# EAGLE design M960 (EAGLE 6.6.0)
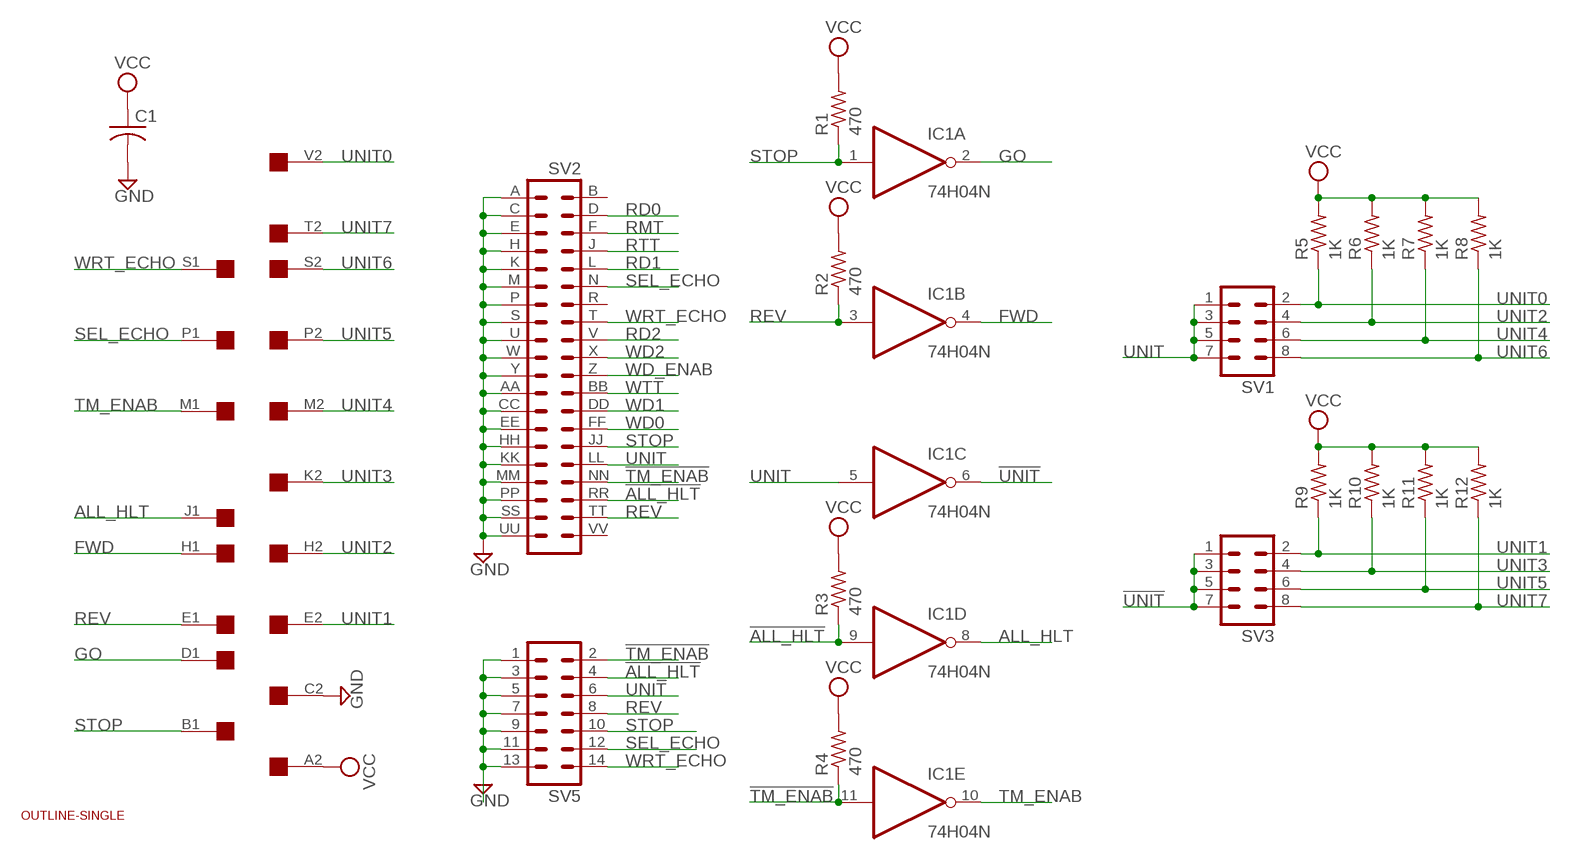
[diagram p0: schematic, sheet 1]

## Parts
C1  C-US050-025X075  [C050-025X075]
IC1  74H04N  7404N  [DIL14]
R1  470  R-US_0207/10  [0207/10]
R2  470  R-US_0207/10  [0207/10]
R3  470  R-US_0207/10  [0207/10]
R4  470  R-US_0207/10  [0207/10]
R5  1K  R-US_0207/10  [0207/10]
R6  1K  R-US_0207/10  [0207/10]
R7  1K  R-US_0207/10  [0207/10]
R8  1K  R-US_0207/10  [0207/10]
R9  1K  R-US_0207/10  [0207/10]
R10  1K  R-US_0207/10  [0207/10]
R11  1K  R-US_0207/10  [0207/10]
R12  1K  R-US_0207/10  [0207/10]
SV1  MA04-2  [MA04-2]
SV2  DEC40PINV  [DEC40PINV]
SV3  MA04-2  [MA04-2]
SV5  MA07-2  [MA07-2]
U$1  OUTLINE-SINGLE  [SINGLE]
U$2  SINGLE  [EDGE-CON2]

## Nets
!ALL_HLT: IC1.9(D:I) R3.1 SV2.RR SV5.4
!TM_ENAB: IC1.11(E:I) R4.1 SV2.NN SV5.2
!UNIT: IC1.6(C:O) SV3.1 SV3.3 SV3.5 SV3.7
ALL_HLT: IC1.8(D:O) U$2.J1
FWD: IC1.4(B:O) U$2.H1
GND: C1.2 SV2.A SV2.AA SV2.C SV2.CC SV2.E SV2.EE SV2.H SV2.HH SV2.K SV2.KK SV2.M SV2.MM SV2.P SV2.PP SV2.S SV2.SS SV2.U SV2.UU SV2.W SV2.Y SV5.1 SV5.3 SV5.5 SV5.7 SV5.9 SV5.11 SV5.13 U$2.C2
GO: IC1.2(A:O) U$2.D1
RD0: SV2.D
RD1: SV2.L
RD2: SV2.V
REV: IC1.3(B:I) R2.1 SV2.TT SV5.8 U$2.E1
RMT: SV2.F
RTT: SV2.J
SEL_ECHO: SV2.N SV5.12 U$2.P1
STOP: IC1.1(A:I) R1.1 SV2.JJ SV5.10 U$2.B1
TM_ENAB: IC1.10(E:O) U$2.M1
UNIT: IC1.5(C:I) SV1.1 SV1.3 SV1.5 SV1.7 SV2.LL SV5.6
UNIT0: R5.1 SV1.2 U$2.V2
UNIT1: R9.1 SV3.2 U$2.E2
UNIT2: R6.1 SV1.4 U$2.H2
UNIT3: R10.1 SV3.4 U$2.K2
UNIT4: R7.1 SV1.6 U$2.M2
UNIT5: R11.1 SV3.6 U$2.P2
UNIT6: R8.1 SV1.8 U$2.S2
UNIT7: R12.1 SV3.8 U$2.T2
VCC: C1.1 R1.2 R2.2 R3.2 R4.2 R5.2 R6.2 R7.2 R8.2 R9.2 R10.2 R11.2 R12.2 U$2.A2
WD0: SV2.FF
WD1: SV2.DD
WD2: SV2.X
WD_ENAB: SV2.Z
WRT_ECHO: SV2.T SV5.14 U$2.S1
WTT: SV2.BB
Unconnected: IC1.12(F:O) IC1.13(F:I) SV2.B SV2.R SV2.VV U$2.A1 U$2.B2 U$2.C1 U$2.D2 U$2.F1 U$2.F2 U$2.J2 U$2.K1 U$2.L1 U$2.L2 U$2.N1 U$2.N2 U$2.R1 U$2.R2 U$2.T1 U$2.U1 U$2.U2 U$2.V1

## Power pins joined to a net without a drawn wire
GND: IC1.7(P:GND)
VCC: IC1.14(P:VCC)

## Library data of the parts
C1 = rcl:C-US: CAPACITOR, American symbol
IC1 = 74xx-us:74*04: Hex INVERTER
R1-R12 = rcl:R-US_: RESISTOR, American symbol
SV1 SV3 = con-lstb:MA04-2: PIN HEADER; OC_FARNELL: unknown; OC_NEWARK: unknown
SV2 = dec-con:DEC40PIN: PIN HEADER
SV5 = con-lstb:MA07-2: PIN HEADER; OC_FARNELL: unknown; OC_NEWARK: unknown
U$1 = dec-con:OUTLINE-*: Board outlines for DEC boards.
U$2 = dec-con:SINGLE: Single-Height DEC board

## Board
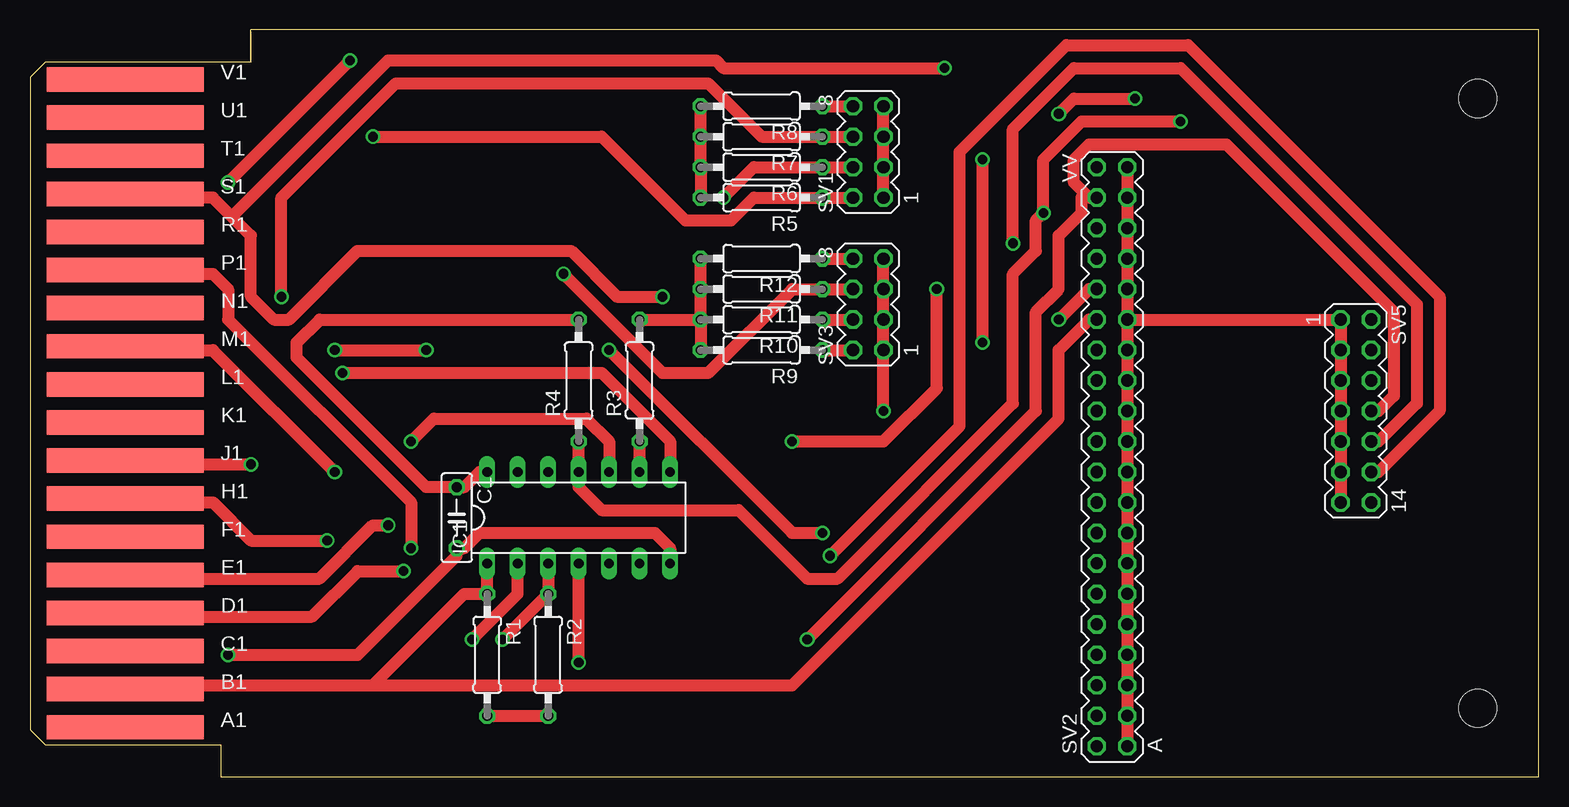
[diagram p1: board, top side]
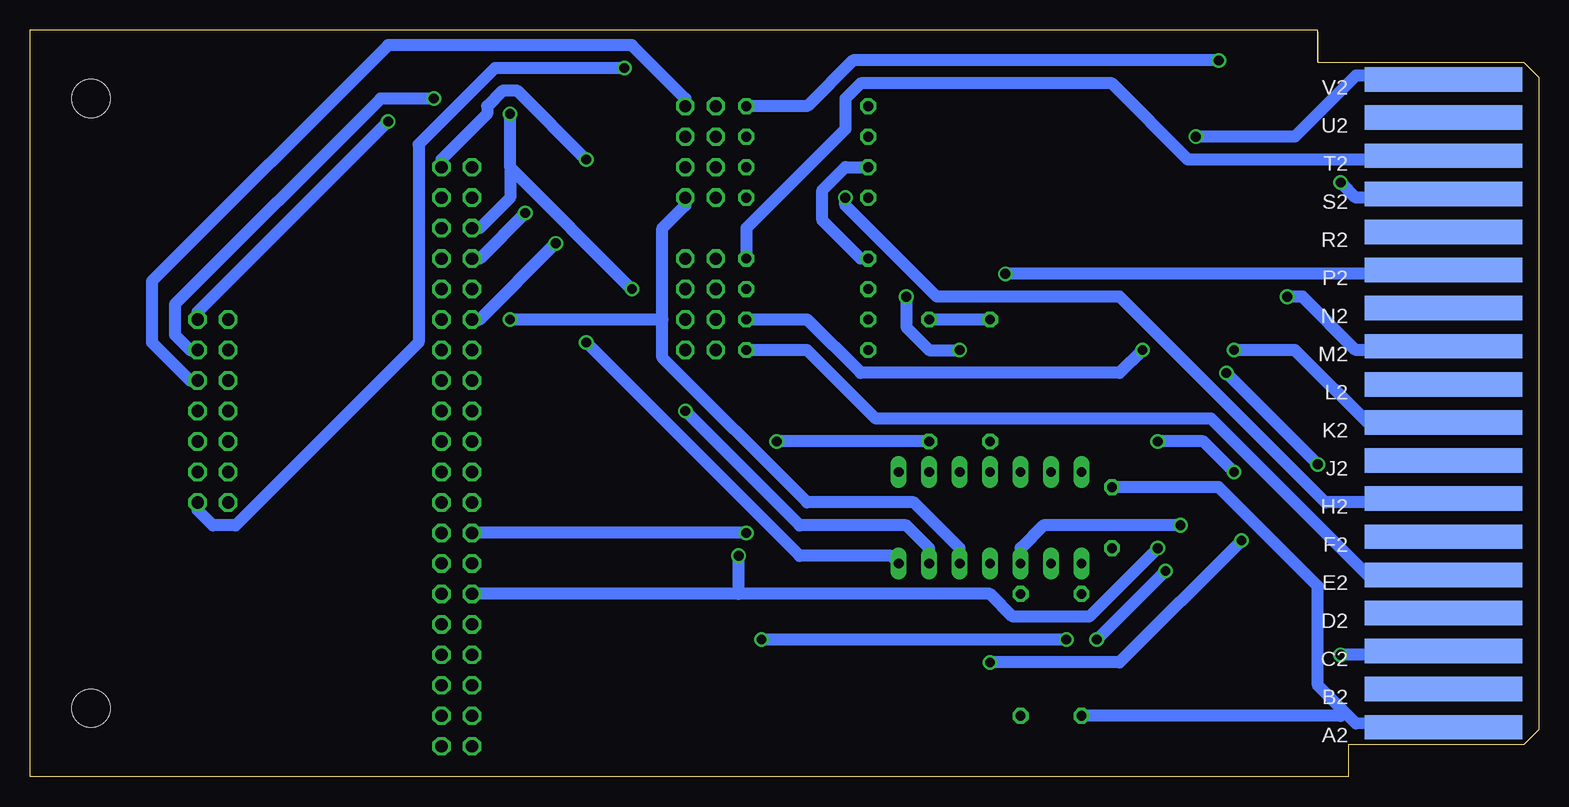
[diagram p2: board, bottom side, seen from below]

Size 125.73 x 62.23 mm. Coordinates in mm from the lower left corner, seen from the top.
Copper layers (1+16): Top 0.035mm / dielectric 1.5mm / Bottom 0.035mm
Design rules "16mils": minimum track width 16mil, minimum drill 32mil, track to track 15mil, track to pad 10mil, pad to pad 10mil, via to via 10mil, smd to smd 10mil, copper to edge 13mil, drill to drill 10mil, minimum pad ring 10mil, minimum via ring 8mil, stop-mask expansion 0mil, vias tented up to drill 0mil, thermal gap 10mil

### Footprints (pad centres in the part's own frame; a part is rotated, then mirrored left to right if it is on the bottom)
C050-025X075 = drill 0.813 octagon: 1 -2.54,0; 2 2.54,0
DIL14 = drill 0.813 long: 1 -7.62,-3.81; 2 -5.08,-3.81; 3 -2.54,-3.81; 4 0,-3.81; 5 2.54,-3.81; 6 5.08,-3.81; 7 7.62,-3.81; 8 7.62,3.81; 9 5.08,3.81; 10 2.54,3.81; 11 0,3.81; 12 -2.54,3.81; 13 -5.08,3.81; 14 -7.62,3.81
0207/10 = drill 0.813 octagon: 1 -5.08,0; 2 5.08,0
MA04-2 = drill 1.016 octagon: 1 -3.81,-1.27; 2 -3.81,1.27; 3 -1.27,-1.27; 4 -1.27,1.27; 5 1.27,-1.27; 6 1.27,1.27; 7 3.81,-1.27; 8 3.81,1.27
DEC40PINV = drill 1.016 octagon: A -24.13,-1.27; AA 3.81,-1.27; B -24.13,1.27; BB 3.81,1.27; C -21.59,-1.27; CC 6.35,-1.27; D -21.59,1.27; DD 6.35,1.27; E -19.05,-1.27; EE 8.89,-1.27; F -19.05,1.27; FF 8.89,1.27; H -16.51,-1.27; HH 11.43,-1.27; J -16.51,1.27; JJ 11.43,1.27; K -13.97,-1.27; KK 13.97,-1.27; L -13.97,1.27; LL 13.97,1.27; M -11.43,-1.27; MM 16.51,-1.27; N -11.43,1.27; NN 16.51,1.27; P -8.89,-1.27; PP 19.05,-1.27; R -8.89,1.27; RR 19.05,1.27; S -6.35,-1.27; SS 21.59,-1.27; T -6.35,1.27; TT 21.59,1.27; U -3.81,-1.27; UU 24.13,-1.27; V -3.81,1.27; VV 24.13,1.27; W -1.27,-1.27; X -1.27,1.27; Y 1.27,-1.27; Z 1.27,1.27
MA07-2 = drill 1.016 octagon: 1 -7.62,-1.27; 2 -7.62,1.27; 3 -5.08,-1.27; 4 -5.08,1.27; 5 -2.54,-1.27; 6 -2.54,1.27; 7 0,-1.27; 8 0,1.27; 9 2.54,-1.27; 10 2.54,1.27; 11 5.08,-1.27; 12 5.08,1.27; 13 7.62,-1.27; 14 7.62,1.27
SINGLE = hole 3.175: 120.65,56.515; 120.65,5.715
EDGE-CON2 = smd 13.106 x 2.032: A1 7.938,4.128; B1 7.938,7.303; C1 7.938,10.477; D1 7.938,13.652; E1 7.938,16.828; F1 7.938,20.003; H1 7.938,23.177; J1 7.938,26.352; K1 7.938,29.527; L1 7.938,32.703; M1 7.938,35.877; N1 7.938,39.053; P1 7.938,42.227; R1 7.938,45.403; S1 7.938,48.578; T1 7.938,51.752; U1 7.938,54.928; V1 7.938,58.102 | smd 13.106 x 2.032 bottom: A2 7.938,4.128; B2 7.938,7.303; C2 7.938,10.477; D2 7.938,13.652; E2 7.938,16.828; F2 7.938,20.003; H2 7.938,23.177; J2 7.938,26.352; K2 7.938,29.527; L2 7.938,32.703; M2 7.938,35.877; N2 7.938,39.053; P2 7.938,42.227; R2 7.938,45.403; S2 7.938,48.578; T2 7.938,51.752; U2 7.938,54.928; V2 7.938,58.102

### Placement (x,y rotation side)
C1  35.56,21.59 270 top
IC1  45.72,21.59 0 top
R1  38.1,10.16 270 top
R2  43.18,10.16 270 top
R3  50.8,33.02 90 top
R4  45.72,33.02 90 top
R5  60.96,48.26 180 top
R6  60.96,50.8 180 top
R7  60.96,53.34 180 top
R8  60.96,55.88 180 top
R9  60.96,35.56 180 top
R10  60.96,38.1 180 top
R11  60.96,40.64 180 top
R12  60.96,43.18 180 top
SV1  69.85,52.07 90 top
SV2  90.17,26.67 90 top
SV3  69.85,39.37 90 top
SV5  110.49,30.48 270 top
U$1  0,0 0 top
U$2  0,0 0 top

### Tracks (layer width: path | path; a pad name or v marks a point on that pad's centre or on a via)
!ALL_HLT  (via drill 0.81)
  Top 1.016: IC1.9 R3.1 | v92.08,56.52 87,56.52 v85.73,55.24 | v63.5,27.94 71.12,27.94 75.57,32.38 v75.57,40.64
  Bottom 1.016: v92.08,56.52 96.52,56.52 113.67,39.37 113.67,36.83 112.4,35.56 SV5.4 | 85.73,50.8 85.73,48.26 88.27,45.72 SV2.RR | 85.73,50.8 v85.73,55.24 | v75.57,40.64 85.73,50.8 | R3.1 v63.5,27.94
!TM_ENAB  (via drill 0.81)
  Top 1.016: R4.1 IC1.11 45.72,24.13 47.63,22.23 59.06,22.23 64.77,16.51 67.31,16.51 81.92,31.11 81.92,41.91 83.82,43.81 83.82,46.35 v84.46,46.99 84.46,51.44 87.63,54.61 v95.89,54.61
  Bottom 1.016: v95.89,54.61 111.76,38.73 SV5.2 | v84.46,46.99 88.27,43.18 SV2.NN
!UNIT  (via drill 0.81)
  Top 1.016: v71.12,30.48 SV3.1 SV3.3 SV3.5 SV3.7
  Bottom 1.016: v71.12,30.48 61.6,20.95 52.71,20.95 50.8,19.05 IC1.6
ALL_HLT  (via drill 0.81)
  Top 1.016: v26.04,33.66 47.63,33.66 53.34,27.94 IC1.8 | v18.42,26.04 12.7,26.04 U$2.J1
  Bottom 1.016: v18.42,26.04 v26.04,33.66
FWD  (via drill 0.81)
  Top 1.016: v24.77,19.68 18.42,19.68 15.24,22.86 13.97,22.86 U$2.H1 | v45.72,9.53 IC1.4
  Bottom 1.016: v45.72,9.53 34.93,9.53 v24.77,19.68
GND  (via drill 0.81)
  Top 1.016: SV5.13 SV5.11 SV5.9 SV5.7 SV5.5 SV5.3 SV5.1 SV2.HH | SV2.A SV2.C SV2.E SV2.H SV2.K SV2.M SV2.P SV2.S SV2.U SV2.W SV2.Y SV2.AA SV2.CC SV2.EE SV2.HH | SV2.HH SV2.KK SV2.MM SV2.PP SV2.SS SV2.UU | IC1.7 53.34,19.05 52.07,20.32 37.47,20.32 36.2,19.05 C1.2 35.56,18.41 27.31,10.16 v16.51,10.16 | v79.38,36.2 v79.38,51.44
  Bottom 1.016: U$2.C2 13.97,10.16 v16.51,10.16 | v79.38,51.44 85.09,57.15 86.36,57.15 87.63,55.88 87.63,55.24 91.44,51.44 SV2.UU | v79.38,36.2 61.6,18.41 53.98,18.41 IC1.7
GO  (via drill 0.81)
  Top 1.016: v36.83,11.43 40.64,15.24 IC1.2 | v31.12,17.14 27.31,17.14 23.5,13.34 12.7,13.34 U$2.D1
  Bottom 1.016: v31.12,17.14 v36.83,11.43
REV  (via drill 0.81)
  Top 1.016: 87.95,48.58 87,49.53 87,51.44 88.27,52.7 99.7,52.7 113.67,38.73 113.67,31.75 112.4,30.48 SV5.8 | 87.95,48.58 88.27,48.26 SV2.TT | IC1.3 R2.1 v39.37,11.43 | v29.85,20.95 28.58,20.95 24.13,16.51 12.7,16.51 U$2.E1 | v64.77,11.43 83.82,30.48 83.82,38.73 85.73,40.64 85.73,45.09 87.63,46.99 87.63,48.26 87.95,48.58
  Bottom 1.016: v29.85,20.95 41.28,20.95 43.18,19.05 IC1.3 | v39.37,11.43 v64.77,11.43
SEL_ECHO  (via drill 0.81)
  Top 1.016: v31.75,19.05 31.75,22.86 16.51,38.1 16.51,40.64 15.24,41.91 13.97,41.91 U$2.P1 | v66.68,18.41 77.47,29.21 77.47,52.07 86.36,60.96 96.52,60.96 117.48,40.01 117.48,30.48 112.4,25.4 SV5.12
  Bottom 1.016: 66.68,15.24 45.72,15.24 43.82,13.34 37.47,13.34 v31.75,19.05 | 66.68,15.24 SV2.N | 66.68,15.24 v66.68,18.41
STOP  (via drill 0.81)
  Top 1.016: IC1.1 R1.1 36.2,15.24 28.58,7.62 | 28.58,7.62 13.97,7.62 U$2.B1 | 28.58,7.62 63.5,7.62 85.73,29.84 85.73,35.56 88.27,38.1 SV2.JJ | v81.92,44.45 81.92,53.98 87,59.05 95.89,59.05 115.57,39.37 115.57,31.11 112.4,27.94 SV5.10
  Bottom 1.016: v81.92,44.45 88.27,38.1 SV2.JJ
TM_ENAB  (via drill 0.81)
  Top 1.016: v31.75,27.94 33.66,29.84 46.36,29.84 48.26,27.94 IC1.10 | v25.4,25.4 15.24,35.56 13.97,35.56 U$2.M1
  Bottom 1.016: v31.75,27.94 27.94,27.94 v25.4,25.4
UNIT  (via drill 0.81)
  Top 1.016: SV1.1 SV1.3 SV1.5 SV1.7 | v85.73,38.1 88.27,40.64 SV2.LL
  Bottom 1.016: 73.03,38.1 73.03,45.72 71.12,47.62 SV1.1 | 73.03,38.1 73.03,34.92 60.96,22.86 52.07,22.86 48.26,19.05 IC1.5 | SV5.6 112.4,33.02 115.57,36.2 115.57,41.27 95.89,60.96 75.57,60.96 71.12,56.52 SV1.7 | 73.03,38.1 v85.73,38.1
UNIT0  (via drill 0.81)
  Top 1.016: SV1.2 R5.1 60.33,48.26 58.42,46.35 54.61,46.35 47.63,53.34 v28.58,53.34
  Bottom 1.016: v28.58,53.34 20.32,53.34 15.24,58.42 13.97,58.42 U$2.V2
UNIT1
  Top 1.016: R9.1 SV3.2
  Bottom 1.016: R9.1 60.96,35.56 55.25,29.84 27.31,29.84 13.97,16.51 U$2.E2
UNIT2  (via drill 0.81)
  Top 1.016: SV1.4 R6.1 60.33,50.8 v57.79,48.26
  Bottom 1.016: v57.79,48.26 57.79,47.62 50.17,40.01 34.93,40.01 17.78,22.86 12.7,22.86 U$2.H2
UNIT3  (via drill 0.81)
  Top 1.016: R10.1 SV3.4 | v25.4,35.56 v33.02,35.56
  Bottom 1.016: v33.02,35.56 34.93,33.66 56.52,33.66 60.96,38.1 R10.1 | v25.4,35.56 20.32,35.56 13.97,29.21 U$2.K2
UNIT4  (via drill 0.81)
  Top 1.016: SV1.6 R7.1 60.96,53.34 56.52,57.78 30.48,57.78 20.96,48.26 v20.96,40.01
  Bottom 1.016: v20.96,40.01 19.69,40.01 15.24,35.56 13.97,35.56 U$2.M2
UNIT5  (via drill 0.81)
  Top 1.016: SV3.6 R11.1 63.5,40.64 56.52,33.66 52.71,33.66 v44.45,41.91
  Bottom 1.016: v44.45,41.91 13.97,41.91 U$2.P2
UNIT6  (via drill 0.81)
  Top 1.016: R8.1 SV1.8 | v16.51,49.53 v26.67,59.69
  Bottom 1.016: v26.67,59.69 57.15,59.69 60.96,55.88 R8.1 | v16.51,49.53 15.24,48.26 13.97,48.26 U$2.S2
UNIT7
  Top 1.016: R12.1 SV3.8
  Bottom 1.016: R12.1 66.04,45.72 57.79,53.98 57.79,56.52 56.52,57.78 35.56,57.78 29.21,51.44 13.97,51.44 U$2.T2
VCC
  Top 1.016: R5.2 R6.2 R7.2 R8.2 | R10.2 R9.2 | R10.2 R11.2 R12.2 | R3.2 R10.2 | R1.2 R2.2 | IC1.14 37.47,25.4 36.2,24.13 C1.1 33.02,24.13 22.23,34.92 22.23,36.2 24.13,38.1 R4.2
  Bottom 1.016: R4.2 R3.2 | R6.2 57.79,50.8 59.69,48.9 59.69,46.35 56.52,43.18 R12.2 | 16.19,5.4 15.24,4.45 U$2.A2 | 16.19,5.4 18.42,7.62 18.42,15.88 26.67,24.13 C1.1 | R1.2 16.51,5.08 16.19,5.4
WRT_ECHO  (via drill 0.81)
  Top 1.016: v66.04,20.32 63.5,20.32 v48.26,35.56 | v52.71,40.01 48.9,40.01 45.09,43.81 27.31,43.81 21.59,38.1 20.32,38.1 18.42,40.01 18.42,45.09 16.83,46.67 | 16.83,46.67 15.24,48.26 13.97,48.26 U$2.S1 | v76.2,59.05 57.79,59.05 57.15,59.69 29.85,59.69 16.83,46.67
  Bottom 1.016: v48.26,35.56 50.8,35.56 52.71,37.47 v52.71,40.01 | v66.04,20.32 SV2.T | v76.2,59.05 87,59.05 93.35,52.7 93.35,36.2 108.59,20.95 110.49,20.95 111.76,22.23 SV5.14

### Text on the board
tValues: Unit6 | Unit4 | Unit2 | Unit0 | Unit7 | Unit5 | Unit3 | Unit1